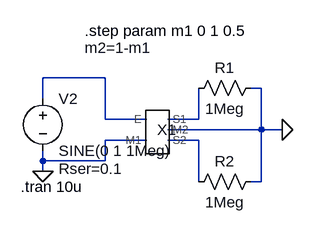
[diagram p0: schematic test_lvdt.asc]
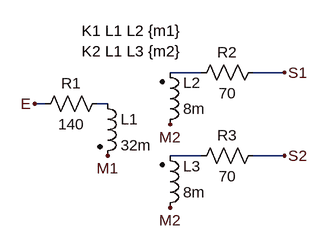
[diagram p1: sub-circuit inductance_mutuelle.asc]
test_lvdt.asc, the LTspice schematic file:
Version 4
SHEET 1 880 680
WIRE 192 96 96 96
WIRE 432 112 416 112
WIRE 96 128 96 96
WIRE 192 160 192 96
WIRE 256 160 192 160
WIRE 336 160 336 112
WIRE 336 160 288 160
WIRE 432 176 432 112
WIRE 432 176 288 176
WIRE 464 176 432 176
WIRE 256 192 192 192
WIRE 336 192 288 192
WIRE 96 224 96 208
WIRE 192 224 192 192
WIRE 192 224 96 224
WIRE 96 240 96 224
WIRE 336 256 336 192
WIRE 432 256 432 176
WIRE 432 256 416 256
FLAG 96 240 0
FLAG 464 176 0
SYMBOL inductance_mutuelle 272 176 R0
WINDOW 3 -17 -22 Left 2
WINDOW 0 0 0 Left 2
WINDOW 39 -112 -126 Left 2
SYMATTR Value ""
SYMATTR InstName X1
SYMATTR SpiceLine m2=1-m1
SYMBOL voltage 96 112 R0
WINDOW 123 0 0 Left 2
WINDOW 39 24 124 Left 2
SYMATTR InstName V2
SYMATTR Value SINE(0 1 1Meg)
SYMATTR SpiceLine Rser=0.1
SYMBOL res 320 128 R270
WINDOW 0 32 56 VTop 2
WINDOW 3 0 56 VBottom 2
SYMATTR InstName R1
SYMATTR Value 1Meg
SYMBOL res 320 272 R270
WINDOW 0 32 56 VTop 2
WINDOW 3 0 56 VBottom 2
SYMATTR InstName R2
SYMATTR Value 1Meg
TEXT 62 264 Left 2 !.tran 10u
TEXT 160 24 Left 2 !.step param m1 0 1 0.5

inductance_mutuelle.asc, the sub-circuit schematic file:
Version 4
SHEET 1 880 680
WIRE 272 48 224 48
WIRE 400 48 352 48
WIRE 32 96 16 96
WIRE 128 96 112 96
WIRE 272 176 224 176
WIRE 400 176 352 176
FLAG 16 96 E
FLAG 400 48 S1
FLAG 400 176 S2
FLAG 128 176 M1
FLAG 224 128 M2
FLAG 224 256 M2
SYMBOL ind2 112 80 R0
SYMATTR InstName L1
SYMATTR Value 32m
SYMATTR Type ind
SYMBOL ind2 208 144 M180
WINDOW 0 36 80 Left 2
WINDOW 3 36 40 Left 2
SYMATTR InstName L2
SYMATTR Value 8m
SYMATTR Type ind
SYMBOL ind2 208 272 M180
WINDOW 0 36 80 Left 2
WINDOW 3 36 40 Left 2
SYMATTR InstName L3
SYMATTR Value 8m
SYMATTR Type ind
SYMBOL res 16 112 R270
WINDOW 0 32 56 VTop 2
WINDOW 3 0 56 VBottom 2
SYMATTR InstName R1
SYMATTR Value 140
SYMBOL res 256 64 R270
WINDOW 0 32 56 VTop 2
WINDOW 3 0 56 VBottom 2
SYMATTR InstName R2
SYMATTR Value 70
SYMBOL res 256 192 R270
WINDOW 0 32 56 VTop 2
WINDOW 3 0 56 VBottom 2
SYMATTR InstName R3
SYMATTR Value 70
TEXT 88 -16 Left 2 !K1 L1 L2 {m1}\nK2 L1 L3 {m2}

The netlist it stands for:
* test_lvdt.asc
XX1 N001 0 N002 N003 0 inductance_mutuelle params: m2=1-m1
V2 N001 0 SINE(0 1 1Meg) Rser=0.1
R1 N002 0 1Meg
R2 N003 0 1Meg

* block symbol definitions
.subckt inductance_mutuelle E M1 S1 S2 M2
L1 N002 M1 32m
L2 M2 N001 8m
L3 M2 N003 8m
R1 E N002 140
R2 N001 S1 70
R3 N003 S2 70
K1 L1 L2 {m1}
K2 L1 L3 {m2}
.ends inductance_mutuelle

.tran 10u
.step param m1 0 1 0.5
.backanno
.end